# Altium project td8655_buck.PrjPcb
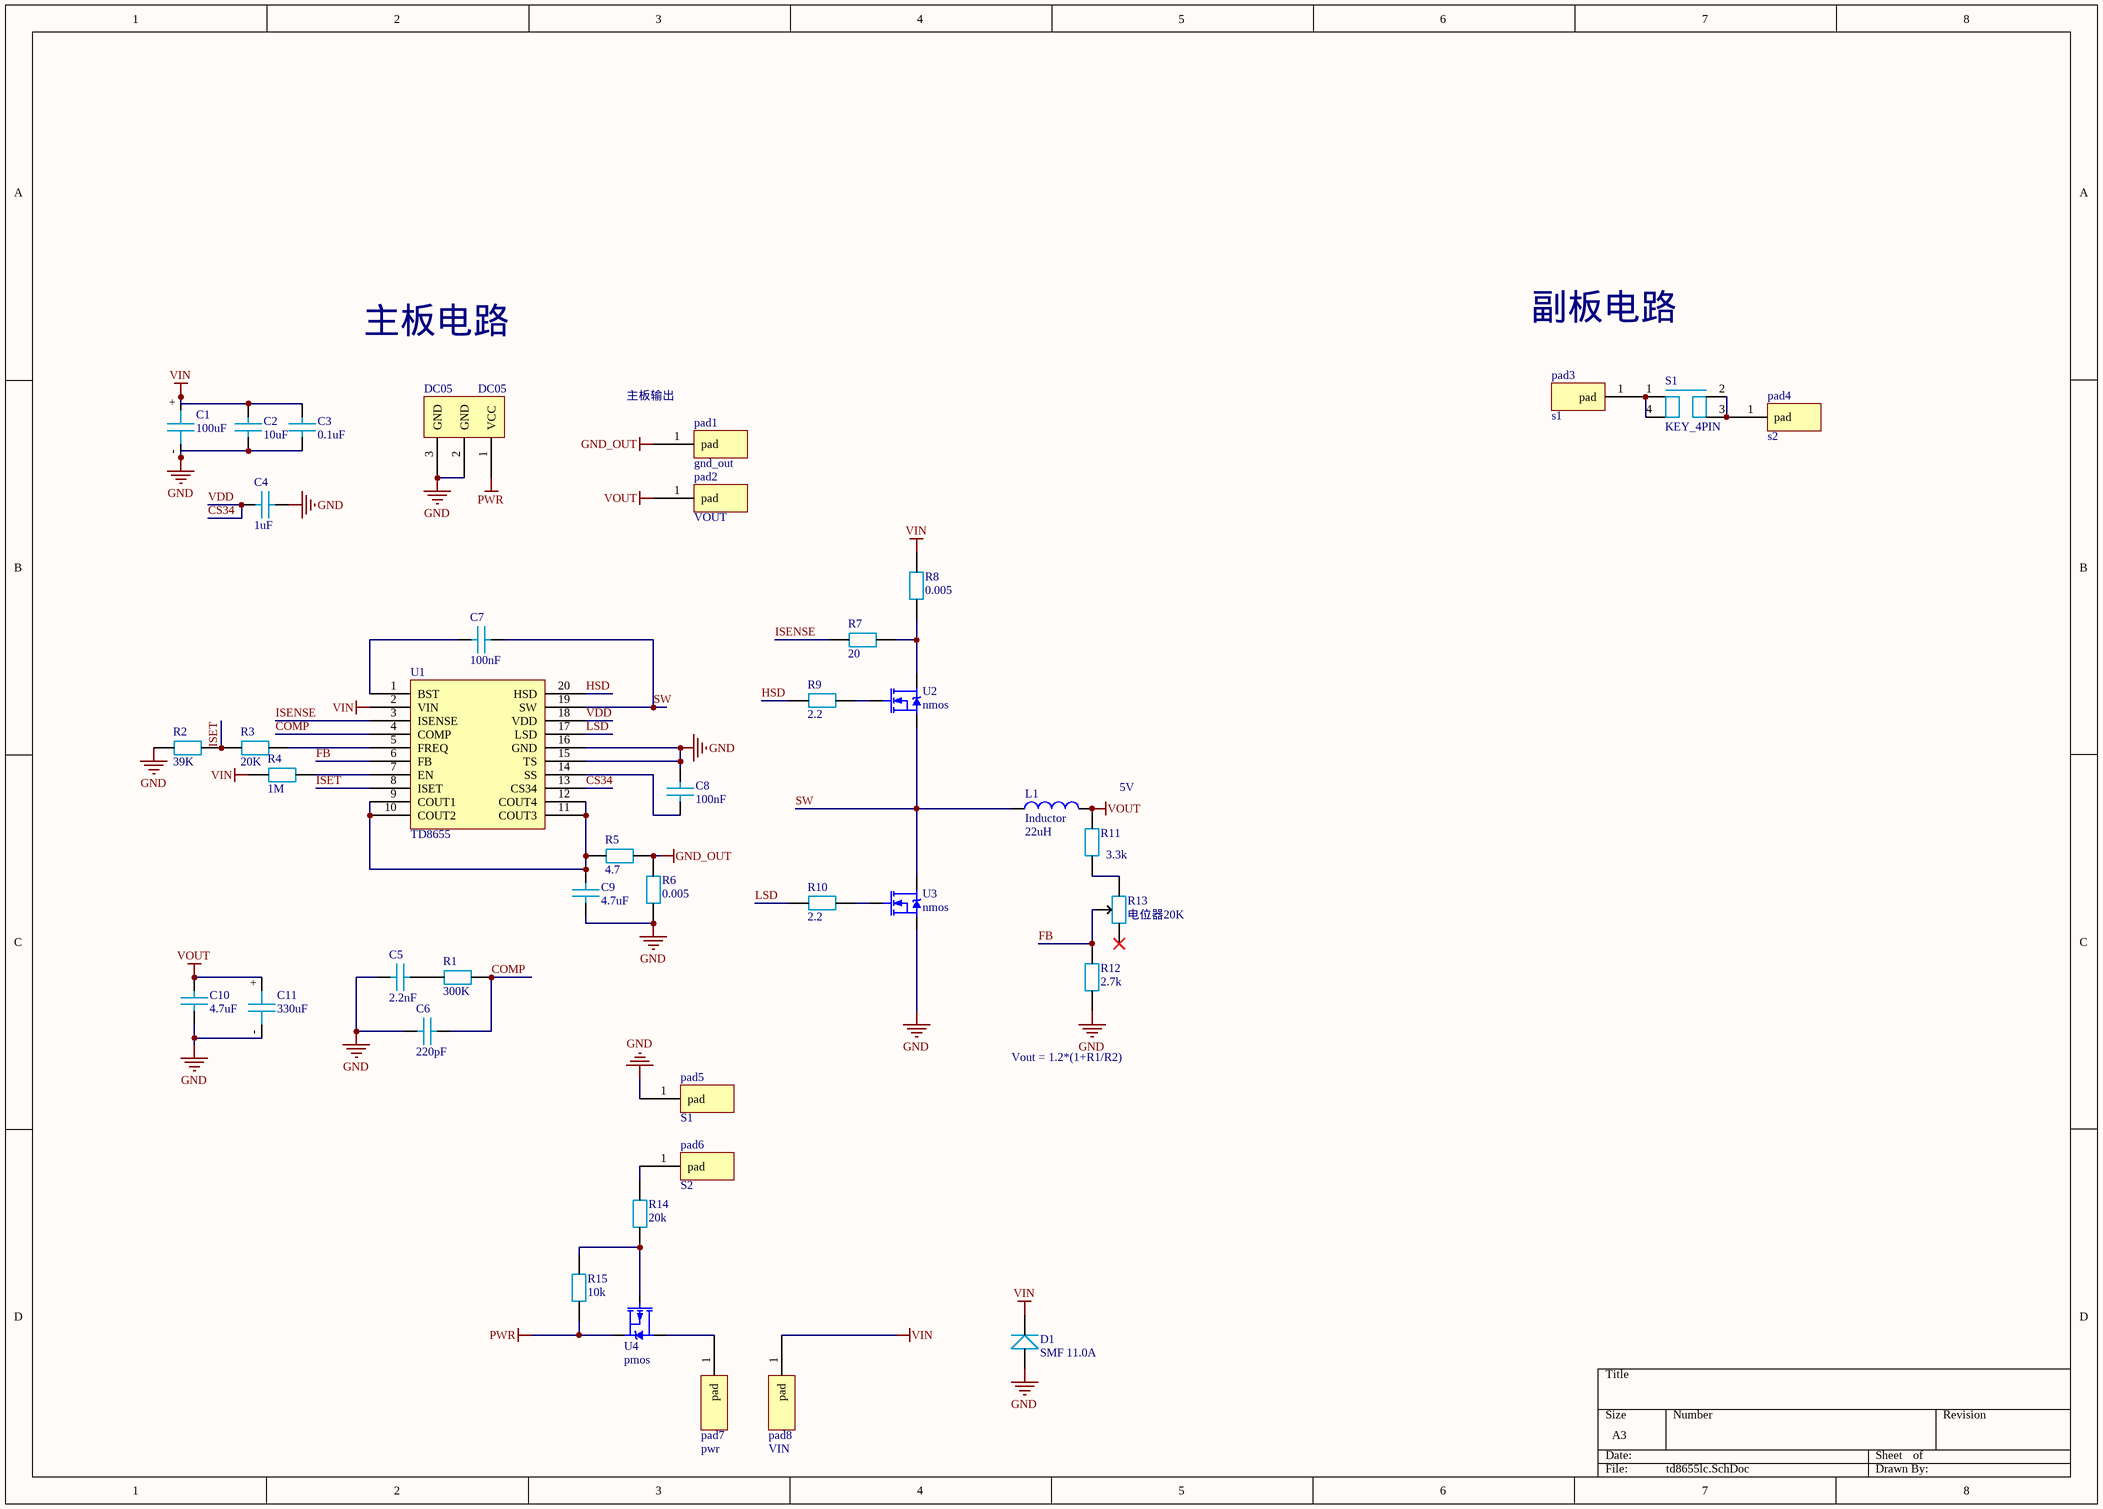
[diagram p0: td8655lc.SchDoc]
1 sheet, 42 parts. Net scope: global (net labels, ports and power ports of the same name join across sheets).
Board file: mainlc.PcbDoc

## Sheet td8655lc.SchDoc
size A3

### Parts
C1  100uF  [DIP-EC3.5X8X11.5-A]
C2  10uF  [0805_C]
C3  0.1uF  [0805_C]
C4  1uF  [0805_C]
C5  2.2nF  [0805_C]
C6  220pF  [0805_C]
C7  100nF  [0805_C]
C8  100nF  [0805_C]
C9  4.7uF  [0805_C]
C10  4.7uF  [0805_C]
C11  330uF  [DIP-EC5.0X10X16-A]
D1  SMF 11.0A  [LC-SOD-123F]
DC05  DC05  [dc003005互通]
L1  Inductor  value 22uH  [1040电感]
pad1  gnd_out  [PAD 3*5]
pad2  VOUT  [PAD 3*5]
pad3  s1  [PAD贴片3*5]
pad4  s2  [PAD贴片3*5]
pad5  S1  [PAD3*3]
pad6  S2  [PAD3*3]
pad7  pwr  [PAD 3*5]
pad8  VIN  [PAD 3*5]
R1  300K  [0805_R]
R2  39K  [0805_R]
R3  20K  [0805_R]
R4  1M  [0805_R]
R5  4.7  [0805_R]
R6  0.005  [1206_R]
R7  20  [0805_R]
R8  0.005  [1206_R]
R9  2.2  [0805_R]
R10  2.2  [0805_R]
R11  3.3k  [0805_R]
R12  2.7k  [0805_R]
R13  电位器20K  [RK097N电位器]
R14  20k  [0805_R]
R15  10k  [0805_R]
S1  KEY_4PIN  [smd4*4轻触开关]
U1  TD8655  [LC-QFN-20_4x4x05P]
U2  nmos  [LC-DFN-8_5x6mm]
U3  nmos  [LC-DFN-8_5x6mm]
U4  pmos  [LC-DFN-8_5x6mm]

### Nets
GND: C1.- C2.1 C3.1 C4.1 C5.1 C6.1 C8.2 C9.1 C10.1 C11.- D1.2 DC05.2(GND) DC05.3(GND) pad5.1(pad) R2.1 R6.1 R12.1 U1.15(TS) U1.16(GND) U3.S
GND_OUT: pad1.1(pad) R5.2 R6.2
PWR: DC05.1(VCC) R15.1 U4.S
VIN: C1.+ C2.2 C3.2 D1.1 pad8.1(pad) R4.1 R8.2 U1.2(VIN)
VOUT: C10.2 C11.+ L1.2 pad2.1(pad) R11.2
COMP: C6.2 R1.2 U1.4(COMP)
CS34: C4.2 U1.13(CS34) U1.18(VDD)  [also labelled VDD]
FB: R12.2 R13.2 U1.6(FB)
HSD: R9.2 U1.20(HSD)
ISENSE: R7.1 U1.3(ISENSE)
ISET: R2.2 R3.1 U1.8(ISET)
LSD: R10.2 U1.17(LSD)
SW: C7.1 L1.1 U1.19(SW) U2.S U3.D
NetC5_2: C5.2 R1.1
NetC7_2: C7.2 U1.1(BST)
NetC8_1: C8.1 U1.14(SS)
NetC9_2: C9.2 R5.1 U1.9(COUT1) U1.10(COUT2) U1.11(COUT3) U1.12(COUT4)
Netpad3_1: pad3.1(pad) S1.1 S1.4
Netpad4_1: pad4.1(pad) S1.2 S1.3
Netpad6_1: pad6.1(pad) R14.2
Netpad7_1: pad7.1(pad) U4.D
NetR3_2: R3.2 U1.5(FREQ)
NetR4_2: R4.2 U1.7(EN)
NetR7_2: R7.2 R8.1 U2.D
NetR9_1: R9.1 U2.G
NetR10_1: R10.1 U3.G
NetR11_1: R11.1 R13.3
NetR14_1: R14.1 R15.2 U4.G

Not connected (* = marked no-connect by the designer): R13 1*

### Notes on the sheet
- 主板电路
- 副板电路
- 主板输出
- 5V
- Vout = 1.2*(1+R1/R2)

### Library data of the parts
C1 C11 = CD
C2-C10 = C
D1 = DIODE: pin to pad: 1>2 2>1
DC05 = DC05: DC05电源
L1 = Inductor: Code_IEC: 1005; Published: 8-Jun-2000; LatestRevisionDate: 29-May-2009; LatestRevisionNote: IPC-7351 Footprint Added.; PackageReference: 0402-A; Publisher: Altium Limited; PackageDescription: Chip Inductor; Code_JEITA: 0402
pad1-pad8 = pad1
R1-R12 R14 R15 = R
R13 = potentialmeter